# Altium schematic sheet USBDM_SWD_JS16CWJ.SchDoc: USBDM_SOIC20_JS16(Minimal)
size A4; Revision: 2.3
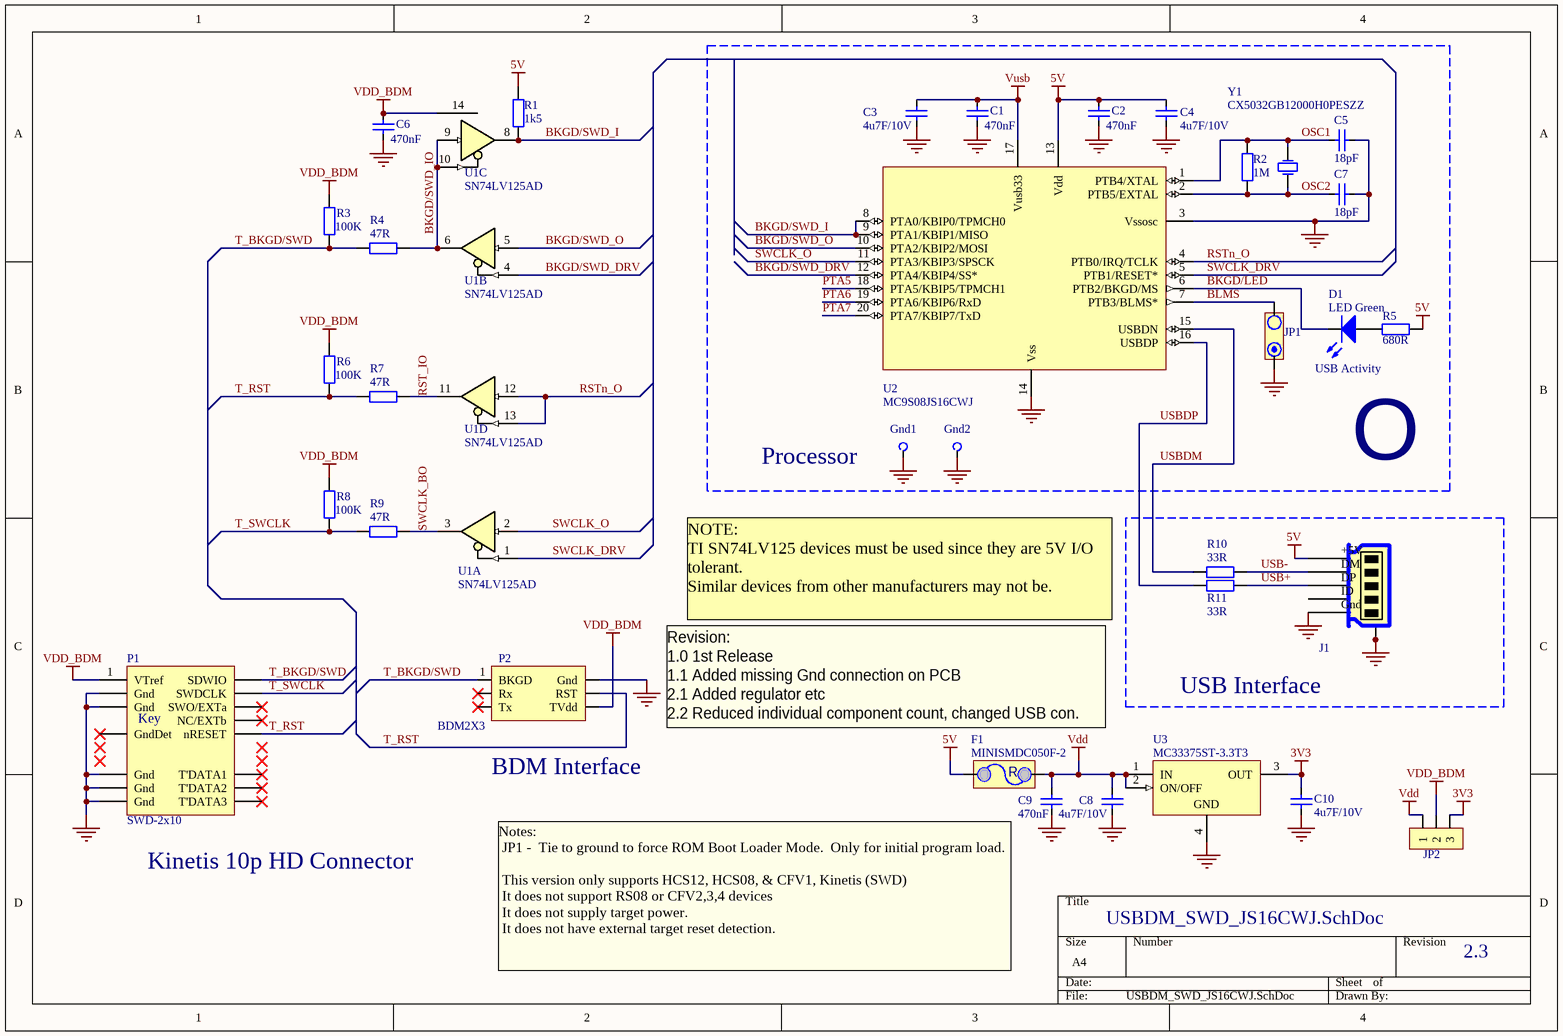
[diagram p0: USBDM_SWD_JS16CWJ.SchDoc]

## Parts
C1  470nF  [CCNP2012-0805]
C2  470nF  [CCNP2012-0805]
C3  4u7F/10V  [CCNP2012-0805]
C4  4u7F/10V  [CCNP2012-0805]
C5  18pF  [CCNP2012-0805]
C6  470nF  [CCNP2012-0805]
C7  18pF  [CCNP2012-0805]
C8  4u7F/10V  [CCNP2012-0805]
C9  470nF  [CCNP2012-0805]
C10  4u7F/10V  [CCNP2012-0805]
D1  LED Green  [LED2012-0805-GREEN]
F1  MINISMDC050F-2  [PTC4532-1812]
Gnd1  TP  [PCBPIN - 0.9mm]  (value not drawn)  (no BOM)
Gnd2  TP  [PCBPIN - 0.9mm]  (value not drawn)  (no BOM)
J1  USB_MICRO_B_CONNECTOR  [MOLEX - 47346-0001]  (value not drawn)
JP1  PIN2X1  [HDR1X2S]  (value not drawn)
JP2  Header 1x3 2mm  [Header 1x3 (2mm)]  (value not drawn)
Logo1  OSHW Logo  [OSHW]  (value not drawn)  (no BOM)
P1  SWD-2x10  [SWD-2x10 - reduced]
P2  BDM2X3  [BDM]
R1  1k5  [CR2012-0805]
R2  1M  [CR2012-0805]
R3  100K  [CR2012-0805]
R4  47R  [CR2012-0805]
R5  680R  [CR2012-0805]
R6  100K  [CR2012-0805]
R7  47R  [CR2012-0805]
R8  100K  [CR2012-0805]
R9  47R  [CR2012-0805]
R10  33R  [CR2012-0805]
R11  33R  [CR2012-0805]
U1  SN74LV125AD  [SO-14_L]  (parts A,B,C,D of 4)
U2  MC9S08JS16CWJ  [SO-G20]
U3  MC33375ST-3.3T3  [SOT223]
Y1  CX5032GB12000H0PESZZ  [XTAL_SMT - 5x3.2]

## Blocks framed on the sheet
Processor: C1-C5 C7 D1 Gnd1 Gnd2 JP1 Logo1 R2 R5 U2 Y1
USB Interface: J1 R10 R11

## Nets
3V3: C10.2 JP2.3 U3.3(OUT)
5V: C2.2 C4.2 F1.1 J1.VBUS(USB+5v) R1.2 R5.2 U2.13(Vdd)
GND: C1.1 C2.1 C3.1 C4.1 C5.1 C6.1 C7.1 C8.1 C9.1 C10.1 Gnd1.1(TP) Gnd2.1(TP) J1.G(USBGnd) J1.S1(USBShd) J1.S2(USBShd) J1.S3(USBShd) J1.S4(USBShd) J1.S5(USBShd) J1.S6(USBShd) JP1.1 P1.3(Gnd) P1.5(Gnd) P1.15(Gnd) P1.17(Gnd) P1.19(Gnd) P2.2(Gnd) U1.7(Gnd) U2.3(Vssosc) U2.14(Vss) U3.4(GND)
Vdd: C8.2 C9.2 F1.2 JP2.1 U3.1(IN) U3.2(ON/OFF)
VDD_BDM: C6.2 JP2.2 P1.1(VTref) P2.6(TVdd) R3.1 R6.1 R8.1 U1.14(Vcc)
Vusb: C1.2 C3.2 U2.17(Vusb33)
BKGD/LED: D1.K U2.6(PTB2/BKGD/MS)
BKGD/SWD_DRV: U1.4(oe2) U2.12(PTA4/KBIP4/SS*)
BKGD/SWD_I: R1.1 U1.8(y3) U2.8(PTA0/KBIP0/TPMCH0) U2.9(PTA1/KBIP1/MISO)
BKGD/SWD_IO: R4.1 U1.6(y2) U1.9(a3) U1.10(oe3)
BKGD/SWD_O: U1.5(a2) U2.10(PTA2/KBIP2/MOSI)
BLMS: JP1.2 U2.7(PTB3/BLMS*)
OSC1: C5.2 R2.2 U2.1(PTB4/XTAL) Y1.2(OSC2)
OSC2: C7.2 R2.1 U2.2(PTB5/EXTAL) Y1.1(OSC1)
PTA5: U2.18(PTA5/KBIP5/TPMCH1)
PTA6: U2.19(PTA6/KBIP6/RxD)
PTA7: U2.20(PTA7/KBIP7/TxD)
RST_IO: R7.1 U1.11(y4)
RSTn_O: U1.12(a4) U1.13(oe4) U2.4(PTB0/IRQ/TCLK)
SWCLK_BO: R9.1 U1.3(y1)
SWCLK_DRV: U1.1(oe1) U2.5(PTB1/RESET*)
SWCLK_O: U1.2(a1) U2.11(PTA3/KBIP3/SPSCK)
T_BKGD/SWD: P1.2(SDWIO) P2.1(BKGD) R3.2 R4.2
T_RST: P1.10(nRESET) P2.4(RST) R6.2 R7.2
T_SWCLK: P1.4(SWDCLK) R8.2 R9.2
USB+: J1.D+(USBDP) R11.1
USB-: J1.D-(USBDM) R10.1
USBDM: R10.2 U2.15(USBDN)
USBDP: R11.2 U2.16(USBDP)
NetD1_A: D1.A R5.1

Not connected (* = marked no-connect by the designer): J1 ID(USB_ID); P1 6(SWO/EXTa)* 8(NC/EXTb)* 9(GndDet)* 16(T'DATA1)* 18(T'DATA2)* 20(T'DATA3)*; P2 3(Rx)* 5(Tx)*

## Notes on the sheet
- USB Activity
- NOTE:
  TI SN74LV125 devices must be used since they are 5V I/O tolerant.
  Similar devices from other manufacturers may not be.
- (near P2) BDM Interface
- Revision:
  1.0 1st Release
  1.1 Added missing Gnd connection on PCB
  2.1 Added regulator etc
  2.2 Reduced individual component count, changed USB con.
- (near P1) Kinetis 10p HD Connector
- Notes:
  JP1 -  Tie to ground to force ROM Boot Loader Mode.  Only for initial program load.
  This version only supports HCS12, HCS08, & CFV1, Kinetis (SWD)
  It does not support RS08 or CFV2,3,4 devices
  It does not supply target power.
  It does not have external target reset detection.
- (in symbol MINISMDC050F-2) R
- (in symbol OSHW Logo) O
- (in symbol SWD2X10-Reduced) Key
- (in symbol USB_MICRO_B_CONNECTOR) +5V; DM; DP; Gnd

## Library data of the parts
C1 C2 C5-C7 C9 = Cap: Capacitor SMT 0805; Manufacturer: Generic Components; Class: Passive; Published: 08/06/2000; Publisher: Altium Hobart Technology Centre; SubClass: Capacitor; Digikey: *
  C1 C2 C6 C9: Value: 470nF; Farnell PN: 2497003
  C5 C7: Value: 18pF; Farnell PN: 2280674
C3 C4 C8 C10 = Cap_CCNP_0805: Capacitor SMT 0805; Manufacturer: Generic Components; Class: Passive; Published: 08/06/2000; Publisher: Altium Hobart Technology Centre; SubClass: Capacitor; Farnell PN: 1327701; Digikey: *; Value: 4u7F/10V
D1 = LED-0805-Green: LED 0805 Green; Manufacturer: Generic Components; Class I: Optoelectronic; Published: 8-Jun-2000; Revision: July-2002: Re-released for DXP Platform.; Publisher: Altium Limited; Class II: LED; Farnell PN: 5790852; Digikey: *
F1 = MINISMDC050F-2: PolySwitch miniSMDC Series, 500 mA, 1 A, 24 VDC; Digikey: *; Farnell PN: 1175839
Gnd1 Gnd2 = TP: Test Point; Digikey: *; Farnell PN: *
J1 = USB_MICRO_B_CONNECTOR: USB Micro-B Connector; Farnell PN: 1568026; Digikey: *
JP2 = Header 1x3 2mm: Header, 1x3, 2mm; Manufacturer: Generic Components; Class I: Connector; Revision: July-2002: Re-released for DXP Platform.; Publisher: Altium Limited; Digikey: *; Farnell PN: *
P1 = SWD2X10-Reduced: SWD Connector 2x10-Pin; LatestRevisionDate: 17-Jul-2002; LatestRevisionNote: Re-released for DXP Platform.; Publisher: Altium Limited; Farnell PN: 1865289
P2 = BDM2X3: HCS12 BDM connector
R1-R11 = Res: Resistor SMT; Manufacturer: Generic Components; Class: Passive; Published: 08/06/2000; Publisher: Altium Hobart Technology Centre; SubClass: Resistor
  R1: Value: 1k5; Farnell PN: 1632464; Digikey: *
  R2: Value: 1M; Farnell PN: 9236392; Digikey: *
  R3: Value: 100K; Farnell PN: 9332405; Digikey: *
  R4 R7 R9: Value: 47R; Farnell PN: 1632490; Digikey: *
  R5: Value: 680R; Farnell PN: 9334785; Digikey: *
  R6 R8: Value: 100K
  R10 R11: Value: 33R; Farnell PN: 1631399; Digikey: *
U1 = 74LV125AD: Quad 3-state Buffer; Digikey: 296-1674-5-ND; Farnell PN: 9592504; Supplier 1: Digi-Key; Supplier Part Number 1: 296-1674-5-ND
U2 = MC9S08JS16CWJ: Microcontroller with USB; Farnell PN: 1704517; Digikey: *
U3 = MC33375ST-3.3T3: Low Dropout 300mA Voltage Regulator with ON/OFF Control; Published: 15-Apr-2002; DatasheetVersion: Mar-2000; PackageVersion: Nov-1999; PackageReference: 318E-04; Publisher: Altium Limited; PackageDescription: SOT-223/SC-73; 4 Leads; Body 6.7 x 7.3 mm, inc. leads (LxW max); ComponentLink1Description: Manufacturer Link; ComponentLink1URL: http://www.onsemi.com/site/products/taxonomy/0,4438,503,00.html; ComponentLink2Description: Datasheet; ComponentLink2URL: http://www.onsemi.com/pub/Collateral/MC33375-D.PDF; Farnell PN: 1150444
Y1 = Crystal - CX5032GB12000H0PESZZ: AVX CRYSTAL, SM, CX-53F, 12MHZ; Manufacturer: Generic Components; Class: Oscillator; SubClass: Crystal Oscillator; Published: 08/06/2000; Publisher: Altium Hobart Technology Centre; Digikey: *; Farnell PN: 1368769
JP1 = PIN2X1: Digikey: *; Farnell PN: *